# EAGLE design arduino_board (EAGLE 9.2.2)
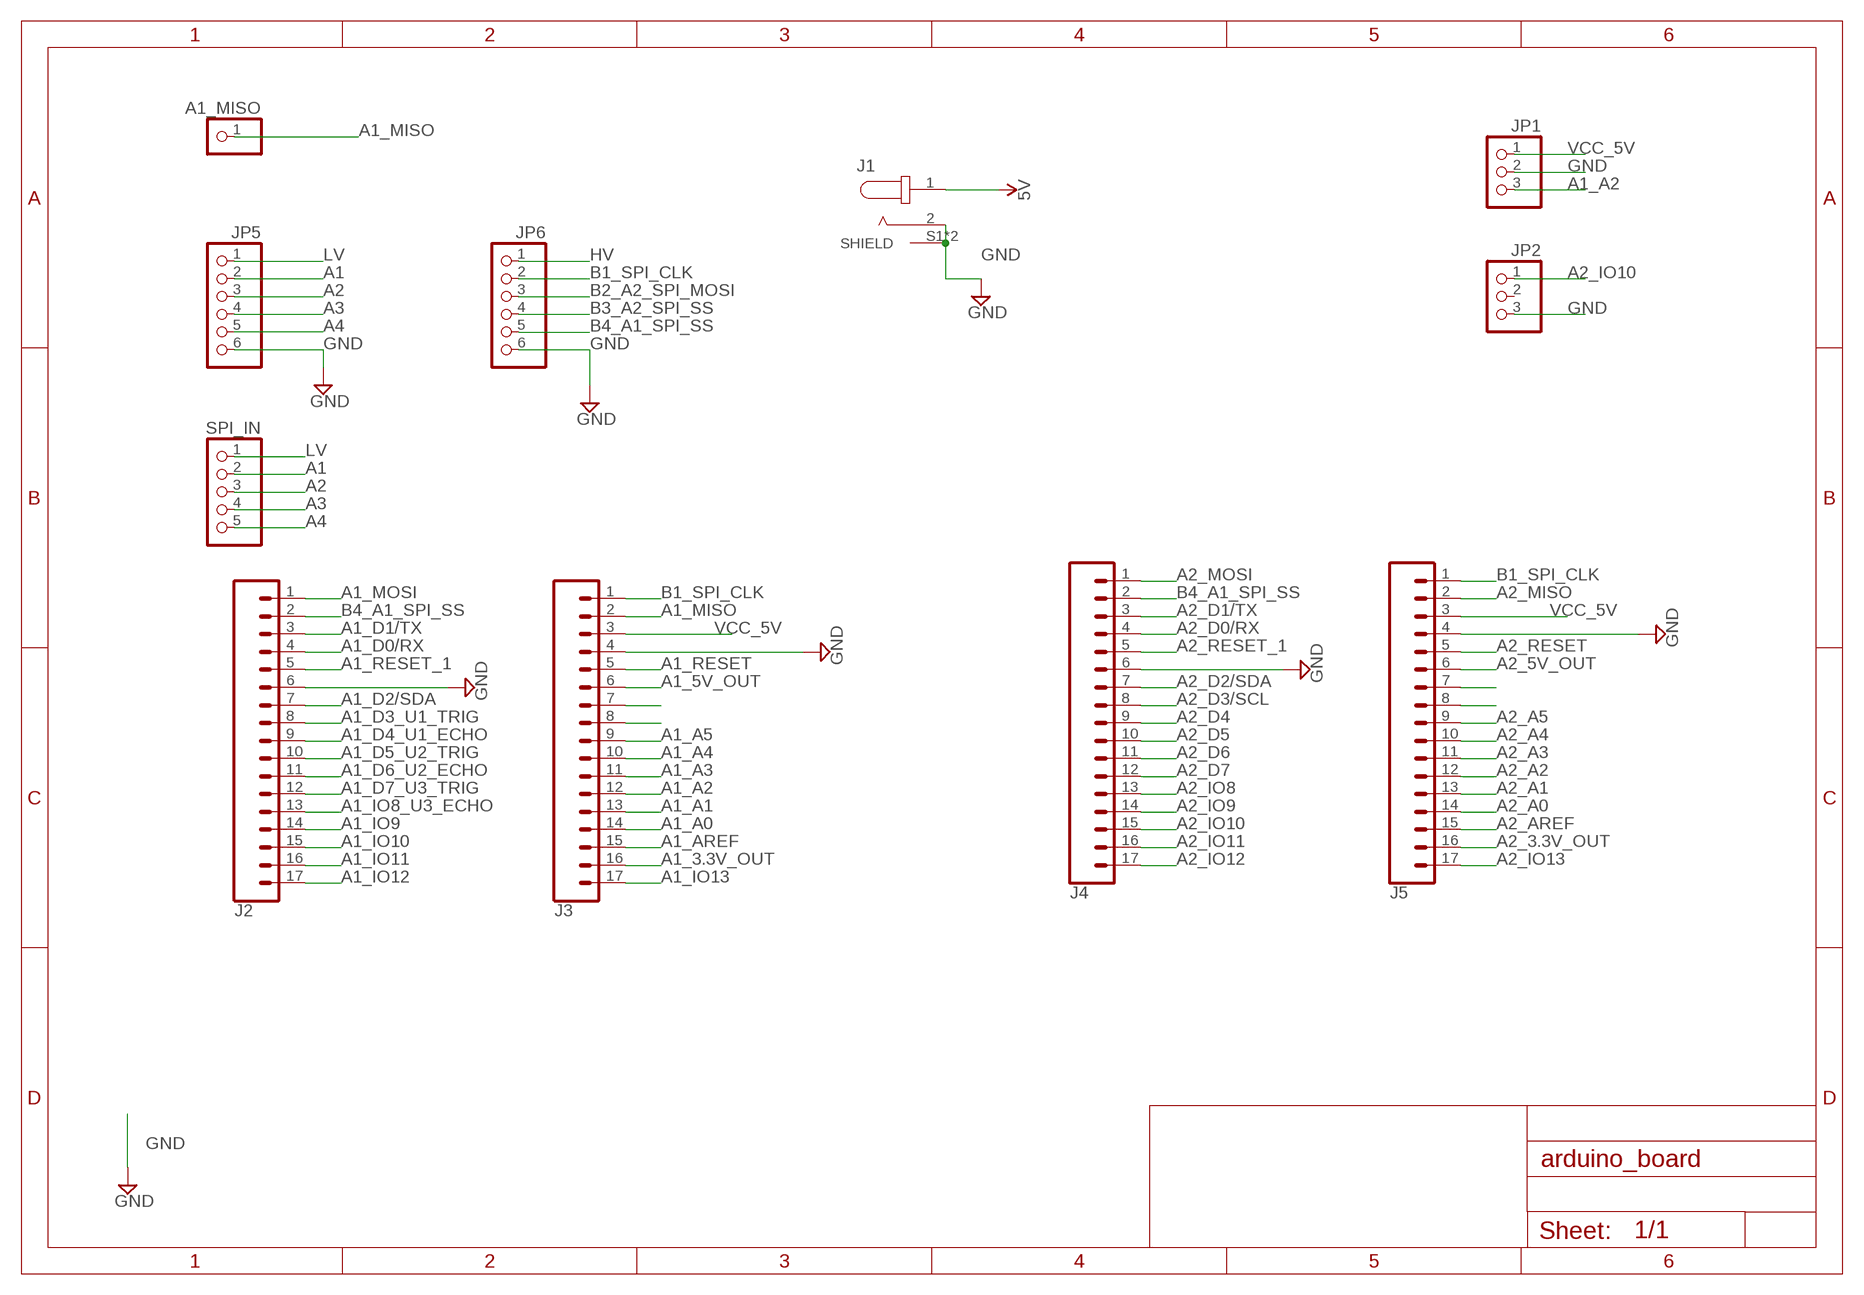
[diagram p0: schematic, sheet 1]

## Parts
A1_MISO  PINHD-1X1  [1X01]
J1  PJ-063AH  [CUI_PJ-063AH]
J2  CONN_17  [1X17]
J3  CONN_17  [1X17]
J4  CONN_17  [1X17]
J5  CONN_17  [1X17]
JP1  PINHD-1X3  [1X03]
JP2  PINHD-1X3  [1X03]
JP5  PINHD-1X6  [1X06]
JP6  PINHD-1X6  [1X06]
SPI_IN  PINHD-1X5  [1X05]

## Nets
5V: J1.1
A1: JP5.2 SPI_IN.2
A1_3.3V_OUT: J3.16
A1_5V_OUT: J3.6
A1_A0: J3.14
A1_A1: J3.13
A1_A2: J3.12 JP1.3
A1_A3: J3.11
A1_A4: J3.10
A1_A5: J3.9
A1_AREF: J3.15
A1_D0/RX: J2.4
A1_D1/TX: J2.3
A1_D2/SDA: J2.7
A1_D3_U1_TRIG: J2.8
A1_D4_U1_ECHO: J2.9
A1_D5_U2_TRIG: J2.10
A1_D6_U2_ECHO: J2.11
A1_D7_U3_TRIG: J2.12
A1_IO8_U3_ECHO: J2.13
A1_IO9: J2.14
A1_IO10: J2.15
A1_IO11: J2.16
A1_IO12: J2.17
A1_IO13: J3.17
A1_MISO: A1_MISO.1 J3.2
A1_MOSI: J2.1
A1_RESET: J3.5
A1_RESET_1: J2.5
A2: JP5.3 SPI_IN.3
A2_3.3V_OUT: J5.16
A2_5V_OUT: J5.6
A2_A0: J5.14
A2_A1: J5.13
A2_A2: J5.12
A2_A3: J5.11
A2_A4: J5.10
A2_A5: J5.9
A2_AREF: J5.15
A2_D0/RX: J4.4
A2_D1/TX: J4.3
A2_D2/SDA: J4.7
A2_D3/SCL: J4.8
A2_D4: J4.9
A2_D5: J4.10
A2_D6: J4.11
A2_D7: J4.12
A2_IO8: J4.13
A2_IO9: J4.14
A2_IO10: J4.15 JP2.1
A2_IO11: J4.16
A2_IO12: J4.17
A2_IO13: J5.17
A2_MISO: J5.2
A2_MOSI: J4.1
A2_RESET: J5.5
A2_RESET_1: J4.5
A3: JP5.4 SPI_IN.4
A4: JP5.5 SPI_IN.5
B1_SPI_CLK: J3.1 J5.1 JP6.2
B2_A2_SPI_MOSI: JP6.3
B3_A2_SPI_SS: JP6.4
B4_A1_SPI_SS: J2.2 J4.2 JP6.5
GND: J1.2 J1.S1(SHIELD) J1.S2(SHIELD) J2.6 J3.4 J4.6 J5.4 JP1.2 JP2.3 JP5.6 JP6.6
HV: JP6.1
LV: JP5.1 SPI_IN.1
N$1: J5.7
N$2: J5.8
N$24: J3.7
N$25: J3.8
VCC_5V: J3.3 J5.3 JP1.1
Unconnected: JP2.2

## Library data of the parts
A1_MISO = adafruit:PINHD-1X1: Pin header 1x1 for 0.1" spacing With round pins
J1 = PJ-063AH:PJ-063AH: 2.0 mm Center Pin, 8.0 A, Right Angle, Through Hole, Shielded, Kinked Pins, Dc Power Jack Connector; AVAILABILITY: Unavailable; CUI_PURCHASE_URL: https://www.cui.com/product/interconnect/dc-power-connectors/jacks/2.0-mm-center-pin/pj-063ah?utm_source=snapeda.com&utm_medium=referral&utm_campaign=snapedaBOM; DESCRIPTION: 2.0 mm Center Pin, 8.0 A, Right Angle, Through Hole, Shielded, Kinked Pins, Dc Power Jack Connector; MF: CUI Inc.; MP: PJ-063AH; PACKAGE: None; PRICE: None
J2-J5 = SparkFun-Connectors:CONN_17: Multi connection point. Often used as Generic Header-pin footprint for 0.1 inch spaced/style header connections On any of the 0.1 inch spaced packages, you can populate with these: Break Away Headers - Straight <https://www.sparkfun.com/products/116> (PRT-00116) Break Away Male Headers - Right Angle <https://www.sparkfun.com/products/553> (PRT-00553) Female Headers <https://www.sparkfun.com/products/115> (PRT-00115) Break Away Headers - Machine Pin <https://www.sparkfun.com/products/117> (PRT-00117) Break Away Female Headers - Swiss Machine Pin <https://www.sparkfun.com/products/743> (PRT-00743) For SCREWTERMINALS and SPRING TERMINALS visit here: Screw Terimnals on SparkFun.com <https://www.sparkfun.com/search/results?term=Screw+Terminals> (5mm/3.5mm/2.54mm spacing) This device is also useful as a general connection point to wire up your design to another part of your project. Our various solder wires solder well into these plated through hole pads. Hook-Up Wire - Assortment (Stranded, 22 AWG) <https://www.sparkfun.com/products/11375> (PRT-11375) Hook-Up Wire - Assortment (Solid Core, 22 AWG) <https://www.sparkfun.com/products/11367> (PRT-11367) View the entire wire category on our website here <https://www.sparkfun.com/categories/141> Special notes: Molex polarized connector foot print use with SKU : PRT-08231 with associated crimp pins and housings. 1MM SMD Version SKU: PRT-10208 NOTES ON THE VARIANTS LOCK and LOCK_LONGPADS... This footprint was designed to help hold the alignment of a through-hole component (i.e. 6-pin header) while soldering it into place. You may notice that each hole has been shifted either up or down by 0.005 of an inch from it's more standard position (which is a perfectly straight line). This slight alteration caused the pins (the squares in the middle) to touch the edges of the holes. Because they are alternating, it causes a "brace" to hold the component in place. 0.005 has proven to be the perfect amount of "off-center" position when using our standard breakaway headers. Although looks a little odd when you look at the bare footprint, once you have a header in there, the alteration is very hard to notice. Also,if you push a header all the way into place, it is covered up entirely on the bottom side.
JP1 JP2 = adafruit:PINHD-1X3: PIN HEADER
JP5 JP6 = adafruit:PINHD-1X6: PIN HEADER
SPI_IN = pinhead:PINHD-1X5: PIN HEADER

## Board
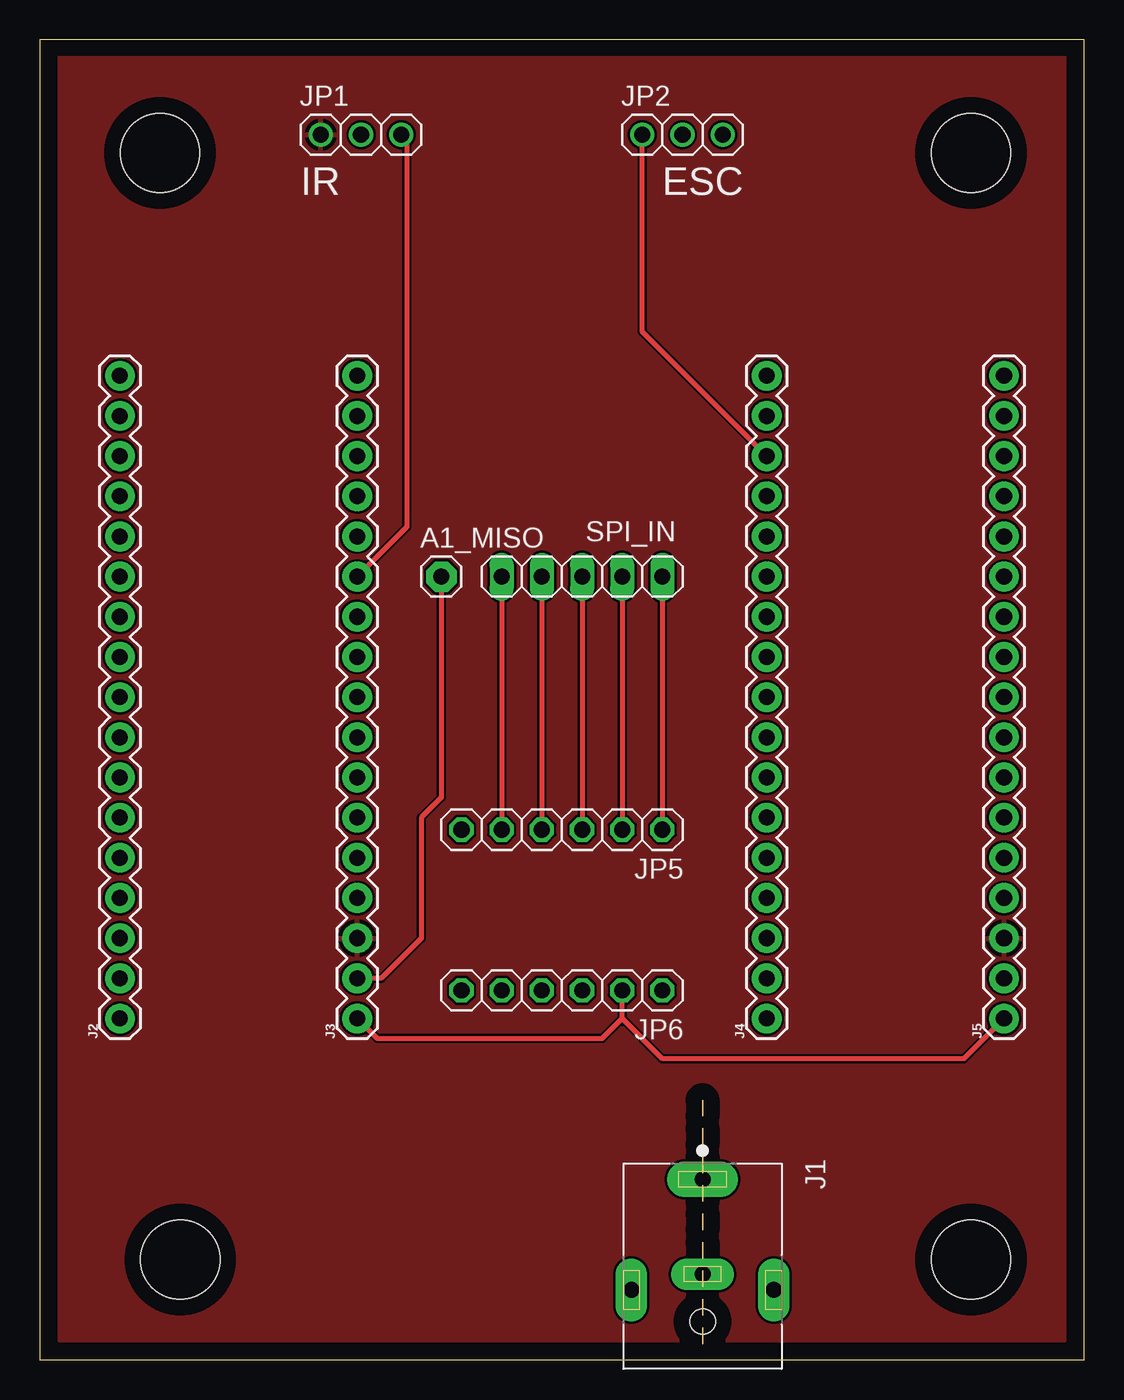
[diagram p1: board, top side]
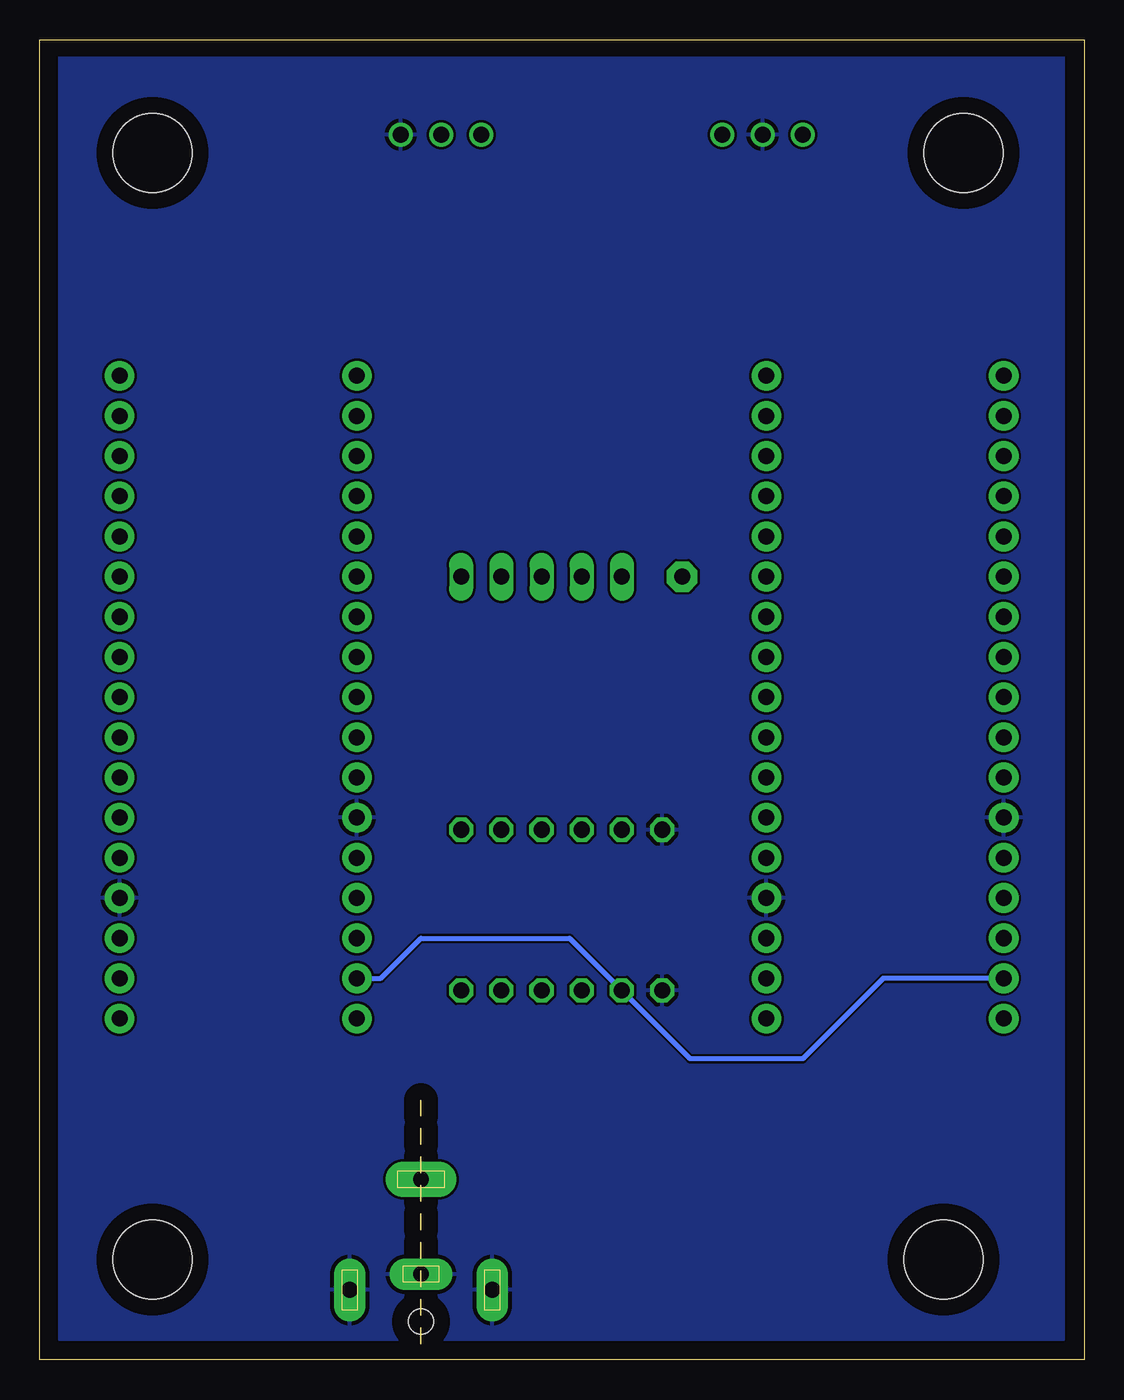
[diagram p2: board, bottom side, seen from below]

Size 66.02 x 83.49 mm. Coordinates in mm from the lower left corner, seen from the top.
Outline: 0,0 66.02,0 66.02,83.49 0,83.49 0,0
Copper layers (1*16): Top 0.035mm / dielectric 1.5mm / Bottom 0.035mm
Design rules "default": minimum track width 6mil, minimum drill 0.35mm, track to track 6mil, track to pad 6mil, pad to pad 6mil, via to via 6mil, smd to smd 6mil, copper to edge 40mil, drill to drill 6mil, minimum pad ring 10mil, minimum via ring 8mil, stop-mask expansion 4mil, vias tented up to drill 0mil, thermal gap 10mil
Holes 5 mm at 8.89,6.35 7.62,76.33 58.88,6.35 58.88,76.33

### Footprints (pad centres in the part's own frame; a part is rotated, then mirrored left to right if it is on the bottom)
1X01 = drill 1.016 pad 1.93 octagon: 1 0,0
CUI_PJ-063AH = drill 1 pad 2.25 long: 1 0,0 | drill 1 pad 2 long: 2 6,0; S1 7,4.5; S2 7,-4.5 | hole 1.6: 9,0
1X17 = drill 1.016 pad 1.88: 1 0,0; 2 2.54,0; 3 5.08,0; 4 7.62,0; 5 10.16,0; 6 12.7,0; 7 15.24,0; 8 17.78,0; 9 20.32,0; 10 22.86,0; 11 25.4,0; 12 27.94,0; 13 30.48,0; 14 33.02,0; 15 35.56,0; 16 38.1,0; 17 40.64,0
1X03 = drill 1.016: 1 -2.54,0; 2 0,0; 3 2.54,0
1X06 = drill 1.016 octagon: 1 -6.35,0; 2 -3.81,0; 3 -1.27,0; 4 1.27,0; 5 3.81,0; 6 6.35,0
1X05 = drill 1.016 long: 1 -5.08,0; 2 -2.54,0; 3 0,0; 4 2.54,0; 5 5.08,0

### Placement (x,y rotation side)
A1_MISO  25.4,49.53 0 top
J1  41.91,11.43 270 top
J2  5.08,21.59 90 top
J3  20.08,21.59 90 top
J4  45.96,21.59 90 top
J5  60.96,21.59 90 top
JP1  20.32,77.47 0 top
JP2  40.64,77.47 0 top
JP5  33.02,33.53 180 top
JP6  33.02,23.37 180 top
SPI_IN  34.29,49.53 180 top

### Tracks (layer width: path | path; a pad name or v marks a point on that pad's centre or on a via)
A1
  Top 0.305: SPI_IN.2 JP5.2
A1_A2
  Top 0.305: J3.12 23.21,52.66 23.21,77.12 JP1.3
A1_MISO
  Top 0.305: A1_MISO.1 25.4,35.56 24.13,34.29 24.13,26.67 21.59,24.13 J3.2
A2
  Top 0.305: SPI_IN.3 JP5.3
A2_IO10
  Top 0.305: J4.15 38.1,65.01 JP2.1
A3
  Top 0.305: SPI_IN.4 JP5.4
A4
  Top 0.305: SPI_IN.5 JP5.5
B1_SPI_CLK
  Top 0.305: J3.1 21.35,20.32 35.56,20.32 36.83,21.59 | 36.83,21.59 JP6.2 | J5.1 58.42,19.05 39.37,19.05 36.83,21.59
B4_A1_SPI_SS
  Bottom 0.305: J2.2 12.7,24.13 17.78,19.05 24.89,19.05 JP6.5 32.51,26.67 41.91,26.67 44.45,24.13 J4.2
GND
  pour Bottom: 1.27,82.55 64.77,82.55 64.77,1.27 1.27,1.27
LV
  Top 0.305: SPI_IN.1 JP5.1
VCC_5V
  pour Top: 1.27,82.55 1.27,1.27 64.77,1.27 64.77,82.55

### Text on the board
tNames: IR | ESC